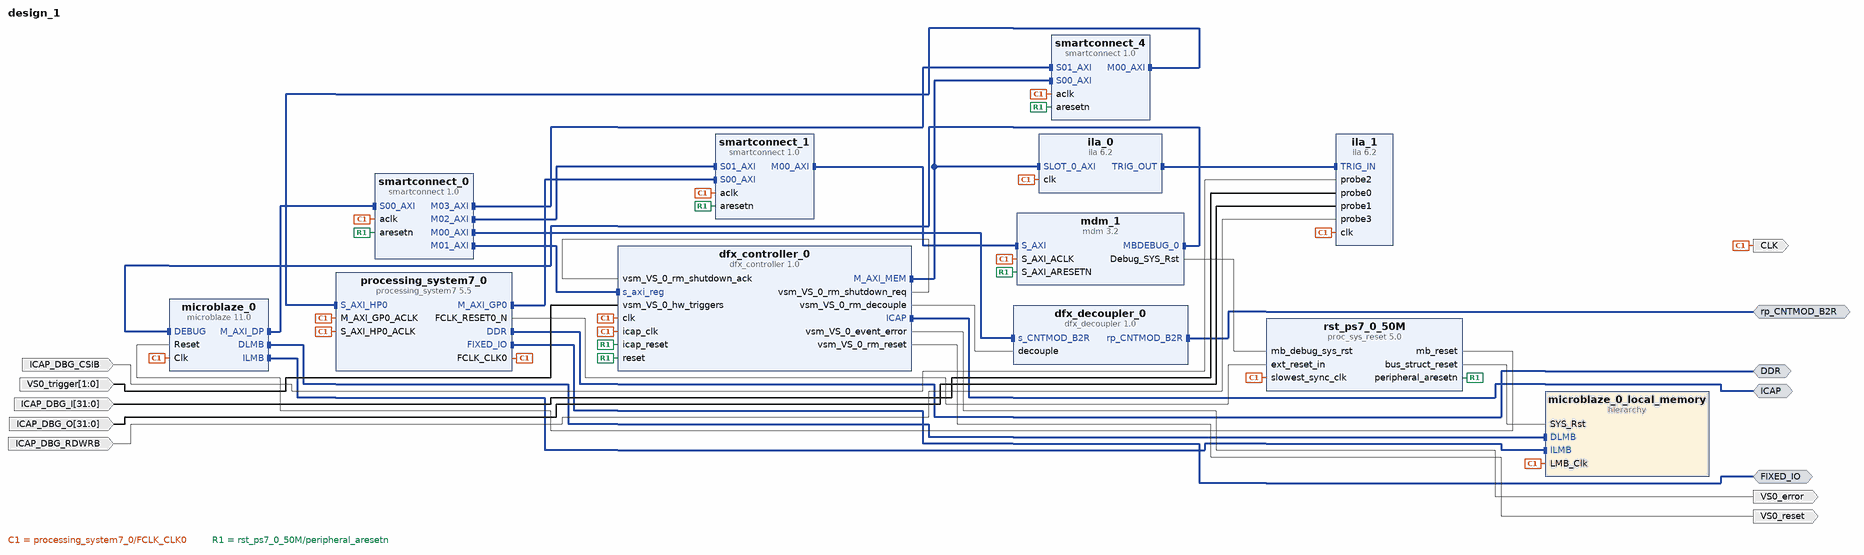
[diagram p0: block diagram of the top level]
# Vivado block design design_1, xc7z020clg400-1, Vivado 2021.1
create_bd_design design_1

create_bd_intf_port -mode Master -vlnv xilinx.com:interface:ddrx_rtl:1.0 DDR
create_bd_intf_port -mode Master -vlnv xilinx.com:display_processing_system7:fixedio_rtl:1.0 FIXED_IO
create_bd_intf_port -mode Master -vlnv xilinx.com:interface:aximm_rtl:1.0 rp_CNTMOD_B2R
set_property -dict [list \
  CONFIG.ADDR_WIDTH 32 \
  CONFIG.DATA_WIDTH 32 \
  CONFIG.HAS_BURST 0 \
  CONFIG.HAS_CACHE 0 \
  CONFIG.HAS_LOCK 0 \
  CONFIG.PROTOCOL AXI4LITE \
] [get_bd_intf_ports rp_CNTMOD_B2R]
create_bd_intf_port -mode Master -vlnv xilinx.com:interface:icap_rtl:1.0 ICAP
create_bd_port -dir O -type clk CLK
set_property -dict {CONFIG.ASSOCIATED_BUSIF rp_CNTMOD_B2R} [get_bd_ports CLK]
create_bd_port -dir I -from 1 -to 0 VS0_trigger
create_bd_port -dir O VS0_reset
create_bd_port -dir O VS0_error
create_bd_port -dir I -from 31 -to 0 ICAP_DBG_I
create_bd_port -dir I -from 31 -to 0 ICAP_DBG_O
create_bd_port -dir I ICAP_DBG_CSIB
create_bd_port -dir I ICAP_DBG_RDWRB

create_bd_cell -type ip -vlnv xilinx.com:ip:processing_system7:5.5 processing_system7_0
set_property -dict [list \
  CONFIG.PCW_APU_PERIPHERAL_FREQMHZ 650 \
  CONFIG.PCW_CRYSTAL_PERIPHERAL_FREQMHZ 50 \
  CONFIG.PCW_ENET0_PERIPHERAL_ENABLE 0 \
  CONFIG.PCW_FPGA0_PERIPHERAL_FREQMHZ 50 \
  CONFIG.PCW_FPGA1_PERIPHERAL_FREQMHZ 50 \
  CONFIG.PCW_GPIO_MIO_GPIO_ENABLE 0 \
  CONFIG.PCW_PERIPHERAL_BOARD_PRESET None \
  CONFIG.PCW_PRESET_BANK1_VOLTAGE {LVCMOS 3.3V} \
  CONFIG.PCW_QSPI_PERIPHERAL_ENABLE 0 \
  CONFIG.PCW_SD0_PERIPHERAL_ENABLE 0 \
  CONFIG.PCW_UART1_PERIPHERAL_ENABLE 0 \
  CONFIG.PCW_UIPARAM_DDR_BUS_WIDTH {16 Bit} \
  CONFIG.PCW_UIPARAM_DDR_FREQ_MHZ 525 \
  CONFIG.PCW_UIPARAM_DDR_PARTNO {MT41J256M16 RE-125} \
  CONFIG.PCW_USB0_PERIPHERAL_ENABLE 0 \
  CONFIG.PCW_USE_S_AXI_HP0 1 \
  CONFIG.preset Default \
] [get_bd_cells processing_system7_0]
# 327 more settings of processing_system7_0 are not shown: defaults, MIO pin electricals, DDR timing, and values the tool derives
create_bd_cell -type ip -vlnv xilinx.com:ip:microblaze:11.0 microblaze_0
set_property -dict {CONFIG.C_DEBUG_ENABLED 1 CONFIG.C_D_AXI 1 CONFIG.C_D_LMB 1 CONFIG.C_I_LMB 1} [get_bd_cells microblaze_0]
create_bd_cell -type hier microblaze_0_local_memory
create_bd_cell -type ip -vlnv xilinx.com:ip:mdm:3.2 mdm_1
set_property -dict {CONFIG.C_ADDR_SIZE 32 CONFIG.C_M_AXI_ADDR_WIDTH 32 CONFIG.C_USE_UART 1} [get_bd_cells mdm_1]
create_bd_cell -type ip -vlnv xilinx.com:ip:proc_sys_reset:5.0 rst_ps7_0_50M
create_bd_cell -type ip -vlnv xilinx.com:ip:smartconnect:1.0 smartconnect_0
set_property -dict {CONFIG.NUM_MI 4 CONFIG.NUM_SI 1} [get_bd_cells smartconnect_0]
create_bd_cell -type ip -vlnv xilinx.com:ip:smartconnect:1.0 smartconnect_1
set_property -dict {CONFIG.NUM_MI 1 CONFIG.NUM_SI 2} [get_bd_cells smartconnect_1]
create_bd_cell -type ip -vlnv xilinx.com:ip:dfx_decoupler:1.0 dfx_decoupler_0
set_property -dict [list \
  CONFIG.ALL_PARAMS {INTF {CNTMOD_B2R {ID 0 VLNV xilinx.com:interface:aximm_rtl:1.0 PROTOCOL axi4lite SIGNALS {ARVALID {PRESENT 1 WIDTH 1} ARREADY {PRESENT 1 WIDTH 1} AWVALID {PRESENT 1 WIDTH 1} AWREADY {PRESENT 1 WIDTH 1} BVALID {PRESENT 1 WIDTH 1} BREADY {PRESENT 1 WIDTH 1} RVALID {PRESENT 1 WIDTH 1} RREADY {PRESENT 1 WIDTH 1} WVALID {PRESENT 1 WIDTH 1} WREADY {PRESENT 1 WIDTH 1} AWADDR {PRESENT 1 WIDTH 32} AWLEN {PRESENT 0 WIDTH 8} AWSIZE {PRESENT 0 WIDTH 3} AWBURST {PRESENT 0 WIDTH 2} AWLOCK {PRESENT 0 WIDTH 1} AWCACHE {PRESENT 0 WIDTH 4} AWPROT {PRESENT 1 WIDTH 3} WDATA {PRESENT 1 WIDTH 32} WSTRB {PRESENT 1 WIDTH 4} WLAST {PRESENT 0 WIDTH 1} BRESP {PRESENT 1 WIDTH 2} ARADDR {PRESENT 1 WIDTH 32} ARLEN {PRESENT 0 WIDTH 8} ARSIZE {PRESENT 0 WIDTH 3} ARBURST {PRESENT 0 WIDTH 2} ARLOCK {PRESENT 0 WIDTH 1} ARCACHE {PRESENT 0 WIDTH 4} ARPROT {PRESENT 1 WIDTH 3} RDATA {PRESENT 1 WIDTH 32} RRESP {PRESENT 1 WIDTH 2} RLAST {PRESENT 0 WIDTH 1} AWID {PRESENT 0 WIDTH 0} AWREGION {PRESENT 1 WIDTH 4} AWQOS {PRESENT 1 WIDTH 4} AWUSER {PRESENT 0 WIDTH 0} WID {PRESENT 0 WIDTH 0} WUSER {PRESENT 0 WIDTH 0} BID {PRESENT 0 WIDTH 0} BUSER {PRESENT 0 WIDTH 0} ARID {PRESENT 0 WIDTH 0} ARREGION {PRESENT 1 WIDTH 4} ARQOS {PRESENT 1 WIDTH 4} ARUSER {PRESENT 0 WIDTH 0} RID {PRESENT 0 WIDTH 0} RUSER {PRESENT 0 WIDTH 0}} MODE slave}} IPI_PROP_COUNT 0} \
  CONFIG.GUI_INTERFACE_NAME CNTMOD_B2R \
  CONFIG.GUI_INTERFACE_PROTOCOL axi4lite \
  CONFIG.GUI_SELECT_INTERFACE 0 \
  CONFIG.GUI_SELECT_MODE slave \
  CONFIG.GUI_SELECT_VLNV xilinx.com:interface:aximm_rtl:1.0 \
  CONFIG.GUI_SIGNAL_DECOUPLED_0 true \
  CONFIG.GUI_SIGNAL_DECOUPLED_1 true \
  CONFIG.GUI_SIGNAL_DECOUPLED_2 true \
  CONFIG.GUI_SIGNAL_DECOUPLED_3 true \
  CONFIG.GUI_SIGNAL_DECOUPLED_4 true \
  CONFIG.GUI_SIGNAL_DECOUPLED_5 true \
  CONFIG.GUI_SIGNAL_DECOUPLED_6 true \
  CONFIG.GUI_SIGNAL_DECOUPLED_7 true \
  CONFIG.GUI_SIGNAL_DECOUPLED_8 true \
  CONFIG.GUI_SIGNAL_DECOUPLED_9 true \
  CONFIG.GUI_SIGNAL_SELECT_0 ARVALID \
  CONFIG.GUI_SIGNAL_SELECT_1 ARREADY \
  CONFIG.GUI_SIGNAL_SELECT_2 AWVALID \
  CONFIG.GUI_SIGNAL_SELECT_3 AWREADY \
  CONFIG.GUI_SIGNAL_SELECT_4 BVALID \
  CONFIG.GUI_SIGNAL_SELECT_5 BREADY \
  CONFIG.GUI_SIGNAL_SELECT_6 RVALID \
  CONFIG.GUI_SIGNAL_SELECT_7 RREADY \
  CONFIG.GUI_SIGNAL_SELECT_8 WVALID \
  CONFIG.GUI_SIGNAL_SELECT_9 WREADY \
] [get_bd_cells dfx_decoupler_0]
create_bd_cell -type ip -vlnv xilinx.com:ip:dfx_controller:1.0 dfx_controller_0
set_property -dict [list \
  CONFIG.ALL_PARAMS {HAS_AXI_LITE_IF 1 RESET_ACTIVE_LEVEL 0 CP_FIFO_DEPTH 32 CP_FIFO_TYPE lutram CDC_STAGES 6 VS {VS_0 {ID 0 NAME VS_0 RM {cnt_mod4 {ID 0 NAME cnt_mod4 BS {0 {ID 0 ADDR 268435456 SIZE 117560 CLEAR 0}} RESET_REQUIRED low} cnt_mod16 {ID 1 NAME cnt_mod16 BS {0 {ID 0 ADDR 268553016 SIZE 117560 CLEAR 0}} RESET_REQUIRED low}} POR_RM cnt_mod4 NUM_HW_TRIGGERS 2 NUM_TRIGGERS_ALLOCATED 2 HAS_AXIS_STATUS 0 HAS_POR_RM 1 START_IN_SHUTDOWN 0 RMS_ALLOCATED 2 HAS_AXIS_CONTROL 0 SKIP_RM_STARTUP_AFTER_RESET 1}} CP_FAMILY 7series DIRTY 3} \
  CONFIG.GUI_BS_ADDRESS_0 0x1001CB38 \
  CONFIG.GUI_BS_SIZE_0 117560 \
  CONFIG.GUI_RESET_ACTIVE_LEVEL 0 \
  CONFIG.GUI_RM_NEW_NAME cnt_mod16 \
  CONFIG.GUI_RM_RESET_REQUIRED low \
  CONFIG.GUI_SELECT_RM 1 \
  CONFIG.GUI_SELECT_TRIGGER_1 1 \
  CONFIG.GUI_SELECT_TRIGGER_3 1 \
  CONFIG.GUI_VS_HAS_AXIS_CONTROL false \
  CONFIG.GUI_VS_HAS_AXIS_STATUS false \
  CONFIG.GUI_VS_HAS_POR_RM true \
  CONFIG.GUI_VS_NUM_HW_TRIGGERS 2 \
  CONFIG.GUI_VS_NUM_RMS_ALLOCATED 2 \
  CONFIG.GUI_VS_SKIP_RM_STARTUP_AFTER_RESET true \
  CONFIG.GUI_VS_START_IN_SHUTDOWN false \
] [get_bd_cells dfx_controller_0]
create_bd_cell -type ip -vlnv xilinx.com:ip:ila:6.2 ila_0
set_property -dict [list \
  CONFIG.ALL_PROBE_SAME_MU_CNT 2 \
  CONFIG.C_ADV_TRIGGER true \
  CONFIG.C_EN_STRG_QUAL 0 \
  CONFIG.C_PROBE0_MU_CNT 2 \
  CONFIG.C_PROBE10_MU_CNT 2 \
  CONFIG.C_PROBE11_MU_CNT 2 \
  CONFIG.C_PROBE12_MU_CNT 2 \
  CONFIG.C_PROBE13_MU_CNT 2 \
  CONFIG.C_PROBE14_MU_CNT 2 \
  CONFIG.C_PROBE15_MU_CNT 2 \
  CONFIG.C_PROBE16_MU_CNT 2 \
  CONFIG.C_PROBE17_MU_CNT 2 \
  CONFIG.C_PROBE18_MU_CNT 2 \
  CONFIG.C_PROBE19_MU_CNT 2 \
  CONFIG.C_PROBE1_MU_CNT 2 \
  CONFIG.C_PROBE20_MU_CNT 2 \
  CONFIG.C_PROBE21_MU_CNT 2 \
  CONFIG.C_PROBE22_MU_CNT 2 \
  CONFIG.C_PROBE23_MU_CNT 2 \
  CONFIG.C_PROBE24_MU_CNT 2 \
  CONFIG.C_PROBE25_MU_CNT 2 \
  CONFIG.C_PROBE26_MU_CNT 2 \
  CONFIG.C_PROBE27_MU_CNT 2 \
  CONFIG.C_PROBE28_MU_CNT 2 \
  CONFIG.C_PROBE29_MU_CNT 2 \
  CONFIG.C_PROBE2_MU_CNT 2 \
  CONFIG.C_PROBE30_MU_CNT 2 \
  CONFIG.C_PROBE31_MU_CNT 2 \
  CONFIG.C_PROBE32_MU_CNT 2 \
  CONFIG.C_PROBE33_MU_CNT 2 \
  CONFIG.C_PROBE34_MU_CNT 2 \
  CONFIG.C_PROBE35_MU_CNT 2 \
  CONFIG.C_PROBE36_MU_CNT 2 \
  CONFIG.C_PROBE37_MU_CNT 2 \
  CONFIG.C_PROBE38_MU_CNT 2 \
  CONFIG.C_PROBE39_MU_CNT 2 \
  CONFIG.C_PROBE3_MU_CNT 2 \
  CONFIG.C_PROBE40_MU_CNT 2 \
  CONFIG.C_PROBE41_MU_CNT 2 \
  CONFIG.C_PROBE42_MU_CNT 2 \
  CONFIG.C_PROBE43_MU_CNT 2 \
  CONFIG.C_PROBE4_MU_CNT 2 \
  CONFIG.C_PROBE5_MU_CNT 2 \
  CONFIG.C_PROBE6_MU_CNT 2 \
  CONFIG.C_PROBE7_MU_CNT 2 \
  CONFIG.C_PROBE8_MU_CNT 2 \
  CONFIG.C_PROBE9_MU_CNT 2 \
  CONFIG.C_TRIGOUT_EN true \
] [get_bd_cells ila_0]
create_bd_cell -type ip -vlnv xilinx.com:ip:ila:6.2 ila_1
set_property -dict [list \
  CONFIG.C_ADV_TRIGGER true \
  CONFIG.C_ENABLE_ILA_AXI_MON false \
  CONFIG.C_MONITOR_TYPE Native \
  CONFIG.C_NUM_OF_PROBES 4 \
  CONFIG.C_PROBE0_WIDTH 32 \
  CONFIG.C_PROBE1_WIDTH 32 \
  CONFIG.C_TRIGIN_EN true \
] [get_bd_cells ila_1]
create_bd_cell -type ip -vlnv xilinx.com:ip:smartconnect:1.0 smartconnect_4

# ---- hierarchy /microblaze_0_local_memory ----
current_bd_instance /microblaze_0_local_memory
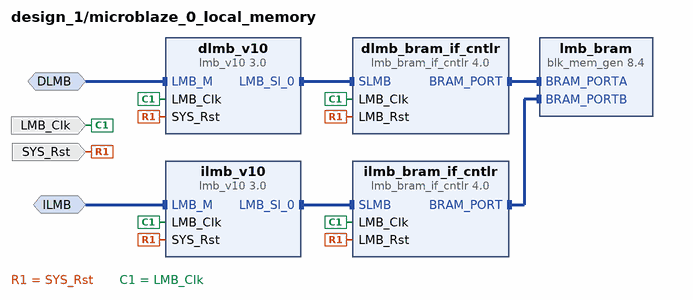
[diagram p1: block diagram inside /microblaze_0_local_memory]
create_bd_intf_pin -mode MirroredMaster -vlnv xilinx.com:interface:lmb_rtl:1.0 DLMB
create_bd_intf_pin -mode MirroredMaster -vlnv xilinx.com:interface:lmb_rtl:1.0 ILMB
create_bd_pin -dir I -type clk LMB_Clk
create_bd_pin -dir I -type rst SYS_Rst

create_bd_cell -type ip -vlnv xilinx.com:ip:lmb_v10:3.0 dlmb_v10
create_bd_cell -type ip -vlnv xilinx.com:ip:lmb_v10:3.0 ilmb_v10
create_bd_cell -type ip -vlnv xilinx.com:ip:lmb_bram_if_cntlr:4.0 dlmb_bram_if_cntlr
set_property -dict {CONFIG.C_ECC 0} [get_bd_cells dlmb_bram_if_cntlr]
create_bd_cell -type ip -vlnv xilinx.com:ip:lmb_bram_if_cntlr:4.0 ilmb_bram_if_cntlr
set_property -dict {CONFIG.C_ECC 0} [get_bd_cells ilmb_bram_if_cntlr]
create_bd_cell -type ip -vlnv xilinx.com:ip:blk_mem_gen:8.4 lmb_bram
set_property -dict {CONFIG.Memory_Type True_Dual_Port_RAM CONFIG.use_bram_block BRAM_Controller} [get_bd_cells lmb_bram]

# ---- connections ----

current_bd_instance /microblaze_0_local_memory
connect_bd_intf_net -intf_net microblaze_0_dlmb [get_bd_intf_pins DLMB] [get_bd_intf_pins dlmb_v10/LMB_M]
connect_bd_intf_net -intf_net microblaze_0_dlmb_bus [get_bd_intf_pins dlmb_v10/LMB_Sl_0] [get_bd_intf_pins dlmb_bram_if_cntlr/SLMB]
connect_bd_intf_net -intf_net microblaze_0_dlmb_cntlr [get_bd_intf_pins dlmb_bram_if_cntlr/BRAM_PORT] [get_bd_intf_pins lmb_bram/BRAM_PORTA]
connect_bd_intf_net -intf_net microblaze_0_ilmb [get_bd_intf_pins ILMB] [get_bd_intf_pins ilmb_v10/LMB_M]
connect_bd_intf_net -intf_net microblaze_0_ilmb_bus [get_bd_intf_pins ilmb_v10/LMB_Sl_0] [get_bd_intf_pins ilmb_bram_if_cntlr/SLMB]
connect_bd_intf_net -intf_net microblaze_0_ilmb_cntlr [get_bd_intf_pins ilmb_bram_if_cntlr/BRAM_PORT] [get_bd_intf_pins lmb_bram/BRAM_PORTB]
connect_bd_net [get_bd_pins SYS_Rst] \
  [get_bd_pins dlmb_v10/SYS_Rst] [get_bd_pins dlmb_bram_if_cntlr/LMB_Rst] [get_bd_pins ilmb_v10/SYS_Rst] \
  [get_bd_pins ilmb_bram_if_cntlr/LMB_Rst]
connect_bd_net -net microblaze_0_Clk [get_bd_pins LMB_Clk] \
  [get_bd_pins dlmb_v10/LMB_Clk] [get_bd_pins dlmb_bram_if_cntlr/LMB_Clk] [get_bd_pins ilmb_v10/LMB_Clk] \
  [get_bd_pins ilmb_bram_if_cntlr/LMB_Clk]
set_property HDL_ATTRIBUTE.BMM_INFO_ADDRESS_SPACE {byte  0x00000000 32 > design_1 microblaze_0_local_memory/lmb_bram} [get_bd_cells dlmb_bram_if_cntlr]
set_property HDL_ATTRIBUTE.KEEP_HIERARCHY yes [get_bd_cells dlmb_bram_if_cntlr]

current_bd_instance /
connect_bd_intf_net [get_bd_intf_ports ICAP] [get_bd_intf_pins dfx_controller_0/ICAP]
connect_bd_intf_net [get_bd_intf_pins dfx_controller_0/M_AXI_MEM] [get_bd_intf_pins smartconnect_4/S00_AXI]
connect_bd_intf_net [get_bd_intf_pins dfx_controller_0/M_AXI_MEM] [get_bd_intf_pins ila_0/SLOT_0_AXI]
connect_bd_intf_net [get_bd_intf_ports rp_CNTMOD_B2R] [get_bd_intf_pins dfx_decoupler_0/rp_CNTMOD_B2R]
connect_bd_intf_net [get_bd_intf_pins ila_0/TRIG_OUT] [get_bd_intf_pins ila_1/TRIG_IN]
connect_bd_intf_net [get_bd_intf_pins microblaze_0/M_AXI_DP] [get_bd_intf_pins smartconnect_0/S00_AXI]
connect_bd_intf_net [get_bd_intf_pins mdm_1/MBDEBUG_0] [get_bd_intf_pins microblaze_0/DEBUG]
connect_bd_intf_net [get_bd_intf_pins microblaze_0/DLMB] [get_bd_intf_pins microblaze_0_local_memory/DLMB]
connect_bd_intf_net [get_bd_intf_pins microblaze_0/ILMB] [get_bd_intf_pins microblaze_0_local_memory/ILMB]
connect_bd_intf_net [get_bd_intf_ports DDR] [get_bd_intf_pins processing_system7_0/DDR]
connect_bd_intf_net [get_bd_intf_ports FIXED_IO] [get_bd_intf_pins processing_system7_0/FIXED_IO]
connect_bd_intf_net [get_bd_intf_pins processing_system7_0/M_AXI_GP0] [get_bd_intf_pins smartconnect_1/S00_AXI]
connect_bd_intf_net [get_bd_intf_pins smartconnect_0/M00_AXI] [get_bd_intf_pins dfx_decoupler_0/s_CNTMOD_B2R]
connect_bd_intf_net [get_bd_intf_pins smartconnect_0/M01_AXI] [get_bd_intf_pins dfx_controller_0/s_axi_reg]
connect_bd_intf_net [get_bd_intf_pins smartconnect_0/M02_AXI] [get_bd_intf_pins smartconnect_1/S01_AXI]
connect_bd_intf_net [get_bd_intf_pins smartconnect_0/M03_AXI] [get_bd_intf_pins smartconnect_4/S01_AXI]
connect_bd_intf_net [get_bd_intf_pins smartconnect_1/M00_AXI] [get_bd_intf_pins mdm_1/S_AXI]
connect_bd_intf_net [get_bd_intf_pins smartconnect_4/M00_AXI] [get_bd_intf_pins processing_system7_0/S_AXI_HP0]
connect_bd_net [get_bd_ports ICAP_DBG_CSIB] [get_bd_pins ila_1/probe2]
connect_bd_net [get_bd_ports ICAP_DBG_I] [get_bd_pins ila_1/probe0]
connect_bd_net [get_bd_ports ICAP_DBG_O] [get_bd_pins ila_1/probe1]
connect_bd_net [get_bd_ports ICAP_DBG_RDWRB] [get_bd_pins ila_1/probe3]
connect_bd_net [get_bd_ports VS0_trigger] [get_bd_pins dfx_controller_0/vsm_VS_0_hw_triggers]
connect_bd_net [get_bd_pins dfx_controller_0/vsm_VS_0_event_error] [get_bd_ports VS0_error]
connect_bd_net [get_bd_pins dfx_controller_0/vsm_VS_0_rm_decouple] [get_bd_pins dfx_decoupler_0/decouple]
connect_bd_net [get_bd_pins dfx_controller_0/vsm_VS_0_rm_reset] [get_bd_ports VS0_reset]
connect_bd_net [get_bd_pins dfx_controller_0/vsm_VS_0_rm_shutdown_req] [get_bd_pins dfx_controller_0/vsm_VS_0_rm_shutdown_ack]
connect_bd_net [get_bd_pins mdm_1/Debug_SYS_Rst] [get_bd_pins rst_ps7_0_50M/mb_debug_sys_rst]
connect_bd_net -net microblaze_0_Clk [get_bd_pins processing_system7_0/FCLK_CLK0] \
  [get_bd_pins microblaze_0/Clk] [get_bd_pins microblaze_0_local_memory/LMB_Clk] [get_bd_pins rst_ps7_0_50M/slowest_sync_clk] \
  [get_bd_pins mdm_1/S_AXI_ACLK] [get_bd_pins processing_system7_0/M_AXI_GP0_ACLK] [get_bd_pins smartconnect_0/aclk] \
  [get_bd_pins smartconnect_1/aclk] [get_bd_ports CLK] [get_bd_pins dfx_controller_0/clk] \
  [get_bd_pins dfx_controller_0/icap_clk] [get_bd_pins ila_0/clk] [get_bd_pins ila_1/clk] [get_bd_pins smartconnect_4/aclk] \
  [get_bd_pins processing_system7_0/S_AXI_HP0_ACLK]
connect_bd_net [get_bd_pins processing_system7_0/FCLK_RESET0_N] [get_bd_pins rst_ps7_0_50M/ext_reset_in]
connect_bd_net [get_bd_pins rst_ps7_0_50M/bus_struct_reset] [get_bd_pins microblaze_0_local_memory/SYS_Rst]
connect_bd_net [get_bd_pins rst_ps7_0_50M/mb_reset] [get_bd_pins microblaze_0/Reset]
connect_bd_net [get_bd_pins rst_ps7_0_50M/peripheral_aresetn] \
  [get_bd_pins mdm_1/S_AXI_ARESETN] [get_bd_pins smartconnect_0/aresetn] [get_bd_pins smartconnect_1/aresetn] \
  [get_bd_pins dfx_controller_0/reset] [get_bd_pins dfx_controller_0/icap_reset] [get_bd_pins smartconnect_4/aresetn]
set_property HDL_ATTRIBUTE.BMM_INFO_PROCESSOR {arm > design_1 axi_bram_ctrl_0} [get_bd_cells processing_system7_0]
set_property HDL_ATTRIBUTE.KEEP_HIERARCHY yes [get_bd_cells processing_system7_0]
set_property HDL_ATTRIBUTE.BMM_INFO_PROCESSOR {microblaze-le > design_1 microblaze_0_local_memory/dlmb_bram_if_cntlr} [get_bd_cells microblaze_0]
set_property HDL_ATTRIBUTE.KEEP_HIERARCHY yes [get_bd_cells microblaze_0]

# ---- address map ----
assign_bd_address -offset 0x10000000 -range 256M -target_address_space [get_bd_addr_spaces dfx_controller_0/Data] [get_bd_addr_segs processing_system7_0/S_AXI_HP0/HP0_DDR_LOWOCM]
exclude_bd_addr_seg -offset 0x20010000 -range 64K -target_address_space [get_bd_addr_spaces dfx_controller_0/Data] [get_bd_addr_segs dfx_controller_0/s_axi_reg/Reg]
assign_bd_address -offset 0x00000000 -range 32K -target_address_space [get_bd_addr_spaces microblaze_0/Data] [get_bd_addr_segs microblaze_0_local_memory/dlmb_bram_if_cntlr/SLMB/Mem]
assign_bd_address -offset 0x10000000 -range 256M -target_address_space [get_bd_addr_spaces microblaze_0/Data] [get_bd_addr_segs processing_system7_0/S_AXI_HP0/HP0_DDR_LOWOCM]
assign_bd_address -offset 0x20000000 -range 64K -target_address_space [get_bd_addr_spaces microblaze_0/Data] [get_bd_addr_segs rp_CNTMOD_B2R/Reg]
assign_bd_address -offset 0x41400000 -range 4K -target_address_space [get_bd_addr_spaces microblaze_0/Data] [get_bd_addr_segs mdm_1/S_AXI/Reg]
assign_bd_address -offset 0x62000000 -range 64K -target_address_space [get_bd_addr_spaces microblaze_0/Data] [get_bd_addr_segs dfx_controller_0/s_axi_reg/Reg]
assign_bd_address -offset 0x00000000 -range 32K -target_address_space [get_bd_addr_spaces microblaze_0/Instruction] [get_bd_addr_segs microblaze_0_local_memory/ilmb_bram_if_cntlr/SLMB/Mem]
assign_bd_address -offset 0x41400000 -range 4K -target_address_space [get_bd_addr_spaces processing_system7_0/Data] [get_bd_addr_segs mdm_1/S_AXI/Reg]

validate_bd_design
save_bd_design
